# Altium project CH32V307.PrjPcb
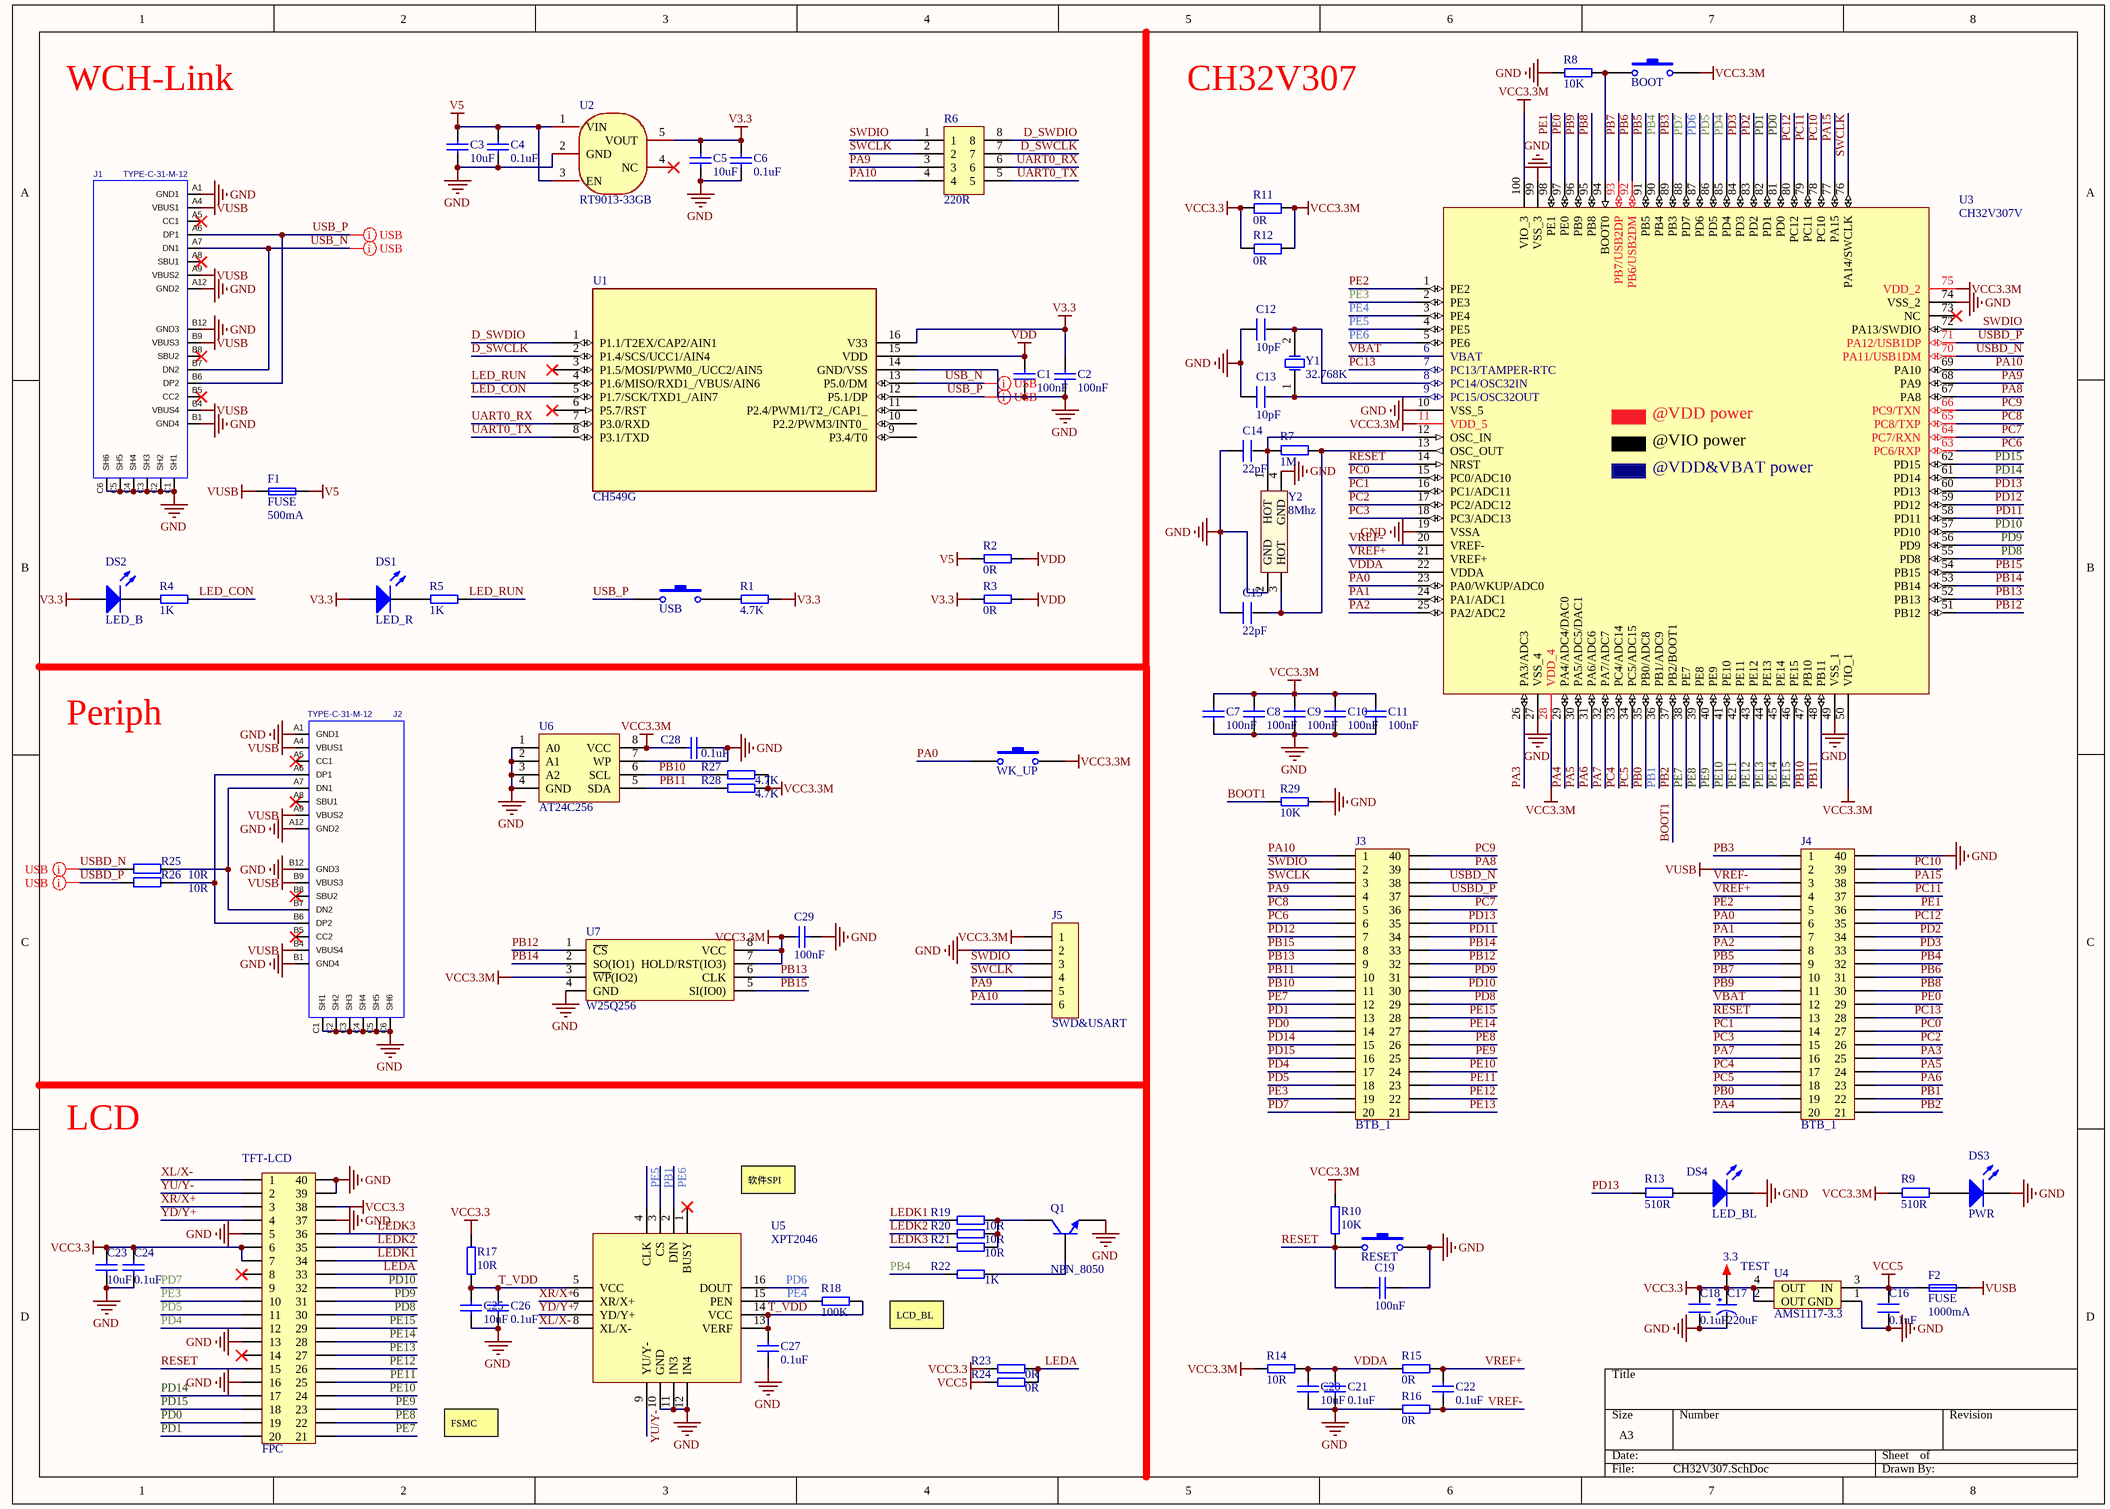
[diagram p0: CH32V307.SchDoc]
1 sheet, 85 parts. Net scope: global (net labels, ports and power ports of the same name join across sheets).
Board file: CH32V307.PcbDoc

## Sheet CH32V307.SchDoc
size A3

### Parts
3.3  TEST  [TEST 1]
C1  value 100nF  [C 0402_L]  (hidden comment: Cap)
C2  value 100nF  [C 0402_L]  (hidden comment: Cap)
C3  value 10uF  [C 0603_L]  (hidden comment: Cap)
C4  value 0.1uF  [C 0402_L]  (hidden comment: Cap)
C5  value 10uF  [C 0603_L]  (hidden comment: Cap)
C6  value 0.1uF  [C 0402_L]  (hidden comment: Cap)
C7  value 100nF  [C 0402_L]  (hidden comment: Cap)
C8  value 100nF  [C 0402_L]  (hidden comment: Cap)
C9  value 100nF  [C 0402_L]  (hidden comment: Cap)
C10  value 100nF  [C 0402_L]  (hidden comment: Cap)
C11  value 100nF  [C 0402_L]  (hidden comment: Cap)
C12  10pF  [C 0402_L]
C13  10pF  [C 0402_L]
C14  22pF  [C 0402_L]
C15  22pF  [C 0402_L]
C16  0.1uF  [C 0402_L]
C17  220uF  [CD A(3216)]
C18  0.1uF  [C 0402_L]
C19  value 100nF  [C 0402_L]  (hidden comment: Cap)
C20  value 10uF  [C 0603_L]  (hidden comment: Cap)
C21  value 0.1uF  [C 0402_L]  (hidden comment: Cap)
C22  value 0.1uF  [C 0402_L]  (hidden comment: Cap)
C23  value 10uF  [C 0603_L]  (hidden comment: Cap)
C24  value 0.1uF  [C 0402_L]  (hidden comment: Cap)
C25  value 10uF  [C 0603_L]  (hidden comment: Cap)
C26  value 0.1uF  [C 0402_L]  (hidden comment: Cap)
C27  value 0.1uF  [C 0402_L]  (hidden comment: Cap)
C28  value 0.1uF  [C 0402_L]  (hidden comment: Cap)
C29  value 100nF  [C 0402_L]  (hidden comment: Cap)
DS1  LED_R  [LC-0603_LED_S1]
DS2  LED_B  [LC-0603_LED_S1]
DS3  PWR  [D-0603-1_LED]
DS4  LED_BL  [D-0603-1_LED]
F1  FUSE  value 500mA  [0805R]
F2  FUSE  value 1000mA  [0805R]
J1  TYPE-C-31-M-12  [TYPE-C-31-M-12]
J2  TYPE-C-31-M-12  [TYPE-C-31-M-12]
J3  BTB_1  [BTB_2_40P]
J4  BTB_1  [BTB_2_40P]
J5  SWD&USART  [CONN-SMD_6P-P1.25_XUNPU_WAFER-GH1.25-6PWB]
K1  USB  [SW-SMD_L3.9-W3.0-P4.45]
K2  BOOT  [SW-SMD_L3.9-W3.0-P4.45]
K4  RESET  [SW-SMD_L3.9-W3.0-P4.45]
K?  WK_UP  [SW-SMD_L3.9-W3.0-P4.45]
Q1  NPN_8050  [SOT323-NPN]
R1  4.7K  [R 0402_L]
R2  0R  [R 0402_L]
R3  0R  [R 0402_L]
R4  1K  [R 0402_L]
R5  1K  [R 0402_L]
R6  value 220R  [8P4R_0603]  (hidden comment: Res_PACK)
R7  1M  [R 0402_L]
R8  10K  [R 0402_L]
R9  510R  [R 0402_L]
R10  10K  [R 0402-HP_L]
R11  0R  [R-0603]
R12  0R  [R-0603]
R13  510R  [R 0402_L]
R14  10R  [R 0402-HP_L]
R15  0R  [R 0402-HP_L]
R16  0R  [R 0402-HP_L]
R17  10R  [R 0402_L]
R18  100K  [R 0402_L]
R19  10R  [R 0402_L]
R20  10R  [R 0402_L]
R21  10R  [R 0402_L]
R22  1K  [R 0402_L]
R23  0R  [R 0402_L]
R24  0R  [R 0402_L]
R25  10R  [R 0402_L]
R26  10R  [R 0402_L]
R27  4.7K  [R 0402_L]
R28  4.7K  [R 0402_L]
R29  10K  [R 0402_L]
TFT-LCD  FPC  [FPC0.5 2H-WS-40P]
U1  CH549G  [SOP16]
U2  RT9013-33GB  [SOT-23-5_L3.0-W1.7-P0.95-LS2.8-BL]
U3  CH32V307V  [LQFP-100_L14.0-W14.0-P0.50-LS16.0-BL]
U4  AMS1117-3.3  [SOT89_M]
U5  XPT2046  [QFN16 4x4_M]
U6  AT24C256  [LC-TSSOP-8_3x4.4x065P - duplicate]
U7  W25Q256  [WSON8]
Y1  32.768K  [XT-3216]
Y2  8Mhz  [XTAL-3225]

### Nets
GND: C1.1 C2.1 C3.1 C4.1 C5.1 C6.1 C7.1 C8.1 C9.1 C10.1 C11.1 C12.1 C13.1 C14.1 C15.1 C16.2 C17.2(GND) C18.2 C19.1 C20.2 C21.2 C23.2 C24.2 C25.2 C26.2 C27.2 C28.1 C29.1 DS3.2(K) DS4.2(K) J1.A1(GND1) J1.A12(GND2) J1.B1(GND4) J1.B12(GND3) J1.C1(SH1) J1.C2(SH2) J1.C3(SH3) J1.C4(SH4) J1.C5(SH5) J1.C6(SH6) J2.A1(GND1) J2.A12(GND2) J2.B1(GND4) J2.B12(GND3) J2.C1(SH1) J2.C2(SH2) J2.C3(SH3) J2.C4(SH4) J2.C5(SH5) J2.C6(SH6) J4.40 J5.2 K4.2 Q1.2(E) R8.1 R16.1 R29.1 TFT-LCD.5 TFT-LCD.13 TFT-LCD.16 TFT-LCD.37 TFT-LCD.39 TFT-LCD.40 U1.14(GND/VSS) U2.2(GND) U3.10(VSS_5) U3.19(VSSA) U3.27(VSS_4) U3.49(VSS_1) U3.74(VSS_2) U3.99(VSS_3) U4.1(GND) U5.10(GND) U5.11(IN3) U5.12(IN4) U6.1(A0) U6.2(A1) U6.3(A2) U6.4(GND) U6.7(WP) U7.4(GND) Y2.2(GND) Y2.4(GND)
V3.3: C2.2 C5.2 C6.2 DS1.1(A) DS2.1(A) R1.2 R3.2 U1.16(V33) U2.5(VOUT)
V5: C3.2 C4.2 F1.2 R2.2 U2.1(VIN) U2.3(EN)
VCC3.3: 3.3.1 C17.1(VCC) C18.1 C23.1 C24.1 R11.1 R12.1 R17.1 R23.1 TFT-LCD.6 TFT-LCD.7 TFT-LCD.38 U4.2(OUT) U4.4(OUT)
VCC3.3M: C7.2 C8.2 C9.2 C10.2 C11.2 C28.2 C29.2 J5.1 K2.2 K?.2 R9.2 R10.1 R11.2 R12.2 R14.1 R27.2 R28.2 U3.11(VDD_5) U3.28(VDD_4) U3.50(VIO_1) U3.75(VDD_2) U3.100(VIO_3) U6.8(VCC) U7.3(~{WP}(IO2)) U7.7(HOLD/RST(IO3)) U7.8(VCC)
VCC5: C16.1 F2.1 R24.1 U4.3(IN)
VDD: C1.2 R2.1 R3.1 U1.15(VDD)
VUSB: F1.1 F2.2 J1.A4(VBUS1) J1.A9(VBUS2) J1.B4(VBUS4) J1.B9(VBUS3) J2.A4(VBUS1) J2.A9(VBUS2) J2.B4(VBUS4) J2.B9(VBUS3) J4.2
BOOT1: J4.21 R29.2 U3.37(PB2/BOOT1)  [also labelled PB2]
D_SWCLK: R6.7 U1.2(P1.4/SCS/UCC1/AIN4)
D_SWDIO: R6.8 U1.1(P1.1/T2EX/CAP2/AIN1)
LED_CON: R4.1 U1.5(P1.7/SCK/TXD1_/AIN7)
LED_RUN: R5.1 U1.4(P1.6/MISO/RXD1_/VBUS/AIN6)
LEDA: R23.2 R24.2 TFT-LCD.33
LEDK1: R19.1 TFT-LCD.34
LEDK2: R20.1 TFT-LCD.35
LEDK3: R21.1 TFT-LCD.36
PA0: J4.6 K?.1 U3.23(PA0/WKUP/ADC0)
PA1: J4.7 U3.24(PA1/ADC1)
PA2: J4.8 U3.25(PA2/ADC2)
PA3: J4.25 U3.26(PA3/ADC3)
PA4: J4.20 U3.29(PA4/ADC4/DAC0)
PA5: J4.24 U3.30(PA5/ADC5/DAC1)
PA6: J4.23 U3.31(PA6/ADC6)
PA7: J4.16 U3.32(PA7/ADC7)
PA8: J3.39 U3.67(PA8)
PA9: J3.4 J5.5 R6.3 U3.68(PA9)
PA10: J3.1 J5.6 R6.4 U3.69(PA10)
PA15: J4.38 U3.77(PA15)
PB0: J4.19 U3.35(PB0/ADC8)
PB1: J4.22 U3.36(PB1/ADC9) U5.3(CS)
PB3: J4.1 U3.89(PB3)
PB4: J4.32 R22.1 U3.90(PB4)
PB5: J4.9 U3.91(PB5)
PB6: J4.31 U3.92(PB6/USB2DM)
PB7: J4.10 U3.93(PB7/USB2DP)
PB8: J4.30 U3.95(PB8)
PB9: J4.11 U3.96(PB9)
PB10: J3.11 R27.1 U3.47(PB10) U6.6(SCL)
PB11: J3.10 R28.1 U3.48(PB11) U6.5(SDA)
PB12: J3.32 U3.51(PB12) U7.1(~{CS})
PB13: J3.9 U3.52(PB13) U7.6(CLK)
PB14: J3.33 U3.53(PB14) U7.2(SO(IO1))
PB15: J3.8 U3.54(PB15) U7.5(SI(IO0))
PC0: J4.27 U3.15(PC0/ADC10)
PC1: J4.14 U3.16(PC1/ADC11)
PC2: J4.26 U3.17(PC2/ADC12)
PC3: J4.15 U3.18(PC3/ADC13)
PC4: J4.17 U3.33(PC4/ADC14)
PC5: J4.18 U3.34(PC5/ADC15)
PC6: J3.6 U3.63(PC6/RXP)
PC7: J3.36 U3.64(PC7/RXN)
PC8: J3.5 U3.65(PC8/TXP)
PC9: J3.40 U3.66(PC9/TXN)
PC10: J4.39 U3.78(PC10)
PC11: J4.37 U3.79(PC11)
PC12: J4.35 U3.80(PC12)
PC13: J4.28 U3.7(PC13/TAMPER-RTC)
PD0: J3.14 TFT-LCD.19 U3.81(PD0)
PD1: J3.13 TFT-LCD.20 U3.82(PD1)
PD2: J4.34 U3.83(PD2)
PD3: J4.33 U3.84(PD3)
PD4: J3.17 TFT-LCD.12 U3.85(PD4)
PD5: J3.18 TFT-LCD.11 U3.86(PD5)
PD6: U3.87(PD6) U5.16(DOUT)
PD7: J3.20 TFT-LCD.9 U3.88(PD7)
PD8: J3.29 TFT-LCD.30 U3.55(PD8)
PD9: J3.31 TFT-LCD.31 U3.56(PD9)
PD10: J3.30 TFT-LCD.32 U3.57(PD10)
PD11: J3.34 U3.58(PD11)
PD12: J3.7 U3.59(PD12)
PD13: J3.35 R13.2 U3.60(PD13)
PD14: J3.15 TFT-LCD.17 U3.61(PD14)
PD15: J3.16 TFT-LCD.18 U3.62(PD15)
PE0: J4.29 U3.97(PE0)
PE1: J4.36 U3.98(PE1)
PE2: J4.5 U3.1(PE2)
PE3: J3.19 TFT-LCD.10 U3.2(PE3)
PE4: R18.2 U3.3(PE4) U5.15(PEN)
PE5: U3.4(PE5) U5.4(CLK)
PE6: U3.5(PE6) U5.2(DIN)
PE7: J3.12 TFT-LCD.21 U3.38(PE7)
PE8: J3.26 TFT-LCD.22 U3.39(PE8)
PE9: J3.25 TFT-LCD.23 U3.40(PE9)
PE10: J3.24 TFT-LCD.24 U3.41(PE10)
PE11: J3.23 TFT-LCD.25 U3.42(PE11)
PE12: J3.22 TFT-LCD.26 U3.43(PE12)
PE13: J3.21 TFT-LCD.27 U3.44(PE13)
PE14: J3.27 TFT-LCD.28 U3.45(PE14)
PE15: J3.28 TFT-LCD.29 U3.46(PE15)
RESET: C19.2 J4.13 K4.1 R10.2 TFT-LCD.15 U3.14(NRST)
SWCLK: J3.3 J5.4 R6.2 U3.76(PA14/SWCLK)
SWDIO: J3.2 J5.3 R6.1 U3.72(PA13/SWDIO)
T_VDD: C25.1 C26.1 C27.1 R17.2 R18.1 U5.5(VCC) U5.13(VERF) U5.14(VCC)
UART0_RX: R6.6 U1.7(P3.0/RXD)
UART0_TX: R6.5 U1.8(P3.1/TXD)
USB_N: J1.A7(DN1) J1.B7(DN2) U1.13(P5.0/DM)
USB_P: J1.A6(DP1) J1.B6(DP2) K1.1 U1.12(P5.1/DP)
USBD_N: J3.38 R25.2 U3.70(PA11/USB1DM)
USBD_P: J3.37 R26.2 U3.71(PA12/USB1DP)
VBAT: J4.12 U3.6(VBAT)
VDDA: C20.1 C21.1 R14.2 R15.1 U3.22(VDDA)
VREF+: C22.1 J4.4 R15.2 U3.21(VREF+)
VREF-: C22.2 J4.3 R16.2 U3.20(VREF-)
XL/X-: TFT-LCD.1 U5.8(XL/X-)
XR/X+: TFT-LCD.3 U5.6(XR/X+)
YD/Y+: TFT-LCD.4 U5.7(YD/Y+)
YU/Y-: TFT-LCD.2 U5.9(YU/Y-)
NetC12_2: C12.2 U3.8(PC14/OSC32IN) Y1.2(OSC2)
NetC13_2: C13.2 U3.9(PC15/OSC32OUT) Y1.1(OSC1)
NetC14_2: C14.2 R7.2 U3.12(OSC_IN) Y2.1(HOT)
NetC15_2: C15.2 R7.1 U3.13(OSC_OUT) Y2.3(HOT)
NetDS1_2: DS1.2(K) R5.2
NetDS2_2: DS2.2(K) R4.2
NetDS3_1: DS3.1(A) R9.1
NetDS4_1: DS4.1(A) R13.1
NetJ2_A6: J2.A6(DP1) J2.B6(DP2) R26.1
NetJ2_A7: J2.A7(DN1) J2.B7(DN2) R25.1
NetK1_2: K1.2 R1.1
NetK2_1: K2.1 R8.2 U3.94(BOOT0)
NetQ1_1: Q1.1(B) R22.2
NetQ1_3: Q1.3(C) R19.2 R20.2 R21.2

Not connected (* = marked no-connect by the designer): J1 A5(CC1)* A8(SBU1)* B5(CC2)* B8(SBU2)*; J2 A5(CC1)* A8(SBU1)* B5(CC2)* B8(SBU2)*; TFT-LCD 8* 14*; U1 3(P1.5/MOSI/PWM0_/UCC2/AIN5)* 6(P5.7/RST)* 9(P3.4/T0) 10(P2.2/PWM3/INT0_) 11(P2.4/PWM1/T2_/CAP1_); U2 4(NC)*; U3 73(NC)*; U5 1(BUSY)*

### Layout directives
differential pair: USB_N, USB_P, USBD_N, USBD_P

### Notes on the sheet
- WCH-Link
- CH32V307
- Periph
- LCD
- (near U5) 软件SPI
- LCD_BL
- FSMC
- (in symbol CH32V307V) @VDD power; @VIO power; @VDD&VBAT power

### Library data of the parts
3.3 = TEST: 测试点; BOM名称: *; 学习资源: *; 版权归属: *
C1-C11 C19-C29 = C-0603: 0603电容; Published: 8-Jun-2000; LatestRevisionDate: 17-Jul-2002; LatestRevisionNote: Re-released for DXP Platform.; PackageReference: RAD-0.3; Publisher: Altium Limited
C12-C16 C18 = C
C17 = CAP
DS1 DS2 = LED: 发光二极管，Typical RED, GREEN, YELLOW, AMBER GaAs LED; Published: 8-Jun-2000; LatestRevisionDate: 17-Jul-2002; LatestRevisionNote: Re-released for DXP Platform.; PackageDocument: Feb-2002; PackageReference: 3.2X1.6X1.1; Publisher: Altium Limited
DS3 DS4 = LED2: Typical RED, GREEN, YELLOW, AMBER GaAs LED; Published: 8-Jun-2000; LatestRevisionDate: 17-Jul-2002; LatestRevisionNote: Re-released for DXP Platform.; PackageDocument: Feb-2002; PackageReference: 3.2X1.6X1.1; Publisher: Altium Limited
F1 F2 = Fuse 1: 保险丝500mA; Published: 8-Jun-2000; LatestRevisionDate: 17-Jul-2002; LatestRevisionNote: Re-released for DXP Platform.; PackageReference: PIN-W2/E2.8; Publisher: Altium Limited; PackageDescription: Thru-Hole; 2 Leads
J1 = TYPE-C-31-M-12: USB_TYPE-C; Source_Path: C:\MYPROGRAM\CADENCE\SPB_16.6\TOOLS\CAPTURE\LIBRARY\SCH.OLB; PCB DECAL: TYPE-C-31-M-12; Value: TYPE-C-31-M-12
J2 = TYPE-C-31-M-12: Source_Path: C:\MYPROGRAM\CADENCE\SPB_16.6\TOOLS\CAPTURE\LIBRARY\SCH.OLB; PCB DECAL: TYPE-C-31-M-12; Value: TYPE-C-31-M-12
J3 J4 = BTB_1_40P: 板对板连接器公
J5 = CON6: 连接器
K1 K2 K4 K? = SW-PB-1_1: 小的贴片开关; Published: 8-August-2017; PackageReference: SWITCH_CEWO; Publisher: mazhongwei
Q1 = NPN_1: SOT-23-3L; Published: 8-Jun-2000; LatestRevisionDate: 17-Jul-2002; LatestRevisionNote: Re-released for DXP Platform.; PackageReference: TO-226-AA; Publisher: Altium Limited; PackageDescription: TO, Flat Index; 3 In-Line, Axial Leads; Body Dia. 4.8mm; Leads 0.55 x 0.51 mm (max); Code_JEDEC: TO-226-AA
R1-R5 R8 R10 R14-R24 R27-R29 = RES: 电阻
R6 = Res_PACK4: 贴片排阻
R7 R9 R11-R13 R25 R26 = R
TFT-LCD = TFT_40PIN: FPC_0.5mm翻盖式
U1 = CH549G: 8bit MCS51 MCU with ADC & USB type-C host & device & dual UART & SPI
U2 = RT9013-33GB: 输出类型:固定;最大输入电压:5.5V;输出电压:3.3V;最大输出电流:500mA;电源纹波抑制比(PSRR):50dB@(10kHz);输出极性:正极;; Manufacturer: RICHTEK(立锜); Add into BOM: yes; Output Type: 固定; Maximum Input Voltage: 5.5V; Output Voltage: 3.3V; MAX Output Current: 500mA; Dropout Voltage: 400mV@(500mA); standby current: 50uA; Output Polarity: 正极; Number of Outputs: 1; Symbol: RT9013-33GB; Device: RT9013-33GB; Supplier: LCSC; Manufacturer Part: RT9013-33GB; Supplier Part: C47773; JLCPCB Part Class: 扩展库; LCSC Part Name: 输入5.5V 输出3.3V 500mA; Supplier Footprint: SOT-23-5; Datasheet: https://atta.szlcsc.com/upload/public/pdf/source/20150504/1457707282459.pdf; Convert to PCB: yes; Power Supply Rejection Ratio (PSRR): 50dB@(10kHz); Noise: -; Feature: -; Operating Temperature: -40℃~+85℃
U3 = CH32V307V: RISC-V FPU HD-MCU, 144MHz, USB_480M, USB OTG, 1000M Ethernet MAC, 2*CAN, FSMC+DVP
U4 = AMS1117
U5 = XPT2046_QFN16: 触摸IC
U7 = W25Q256: 外置flash
Y1 = XTAL_1: Crystal Oscillator; Published: 8-Jun-2000; LatestRevisionDate: 17-Jul-2002; LatestRevisionNote: Re-released for DXP Platform.; Publisher: Altium Limited
Y2 = XTAL_3225: 3225贴片无源晶振